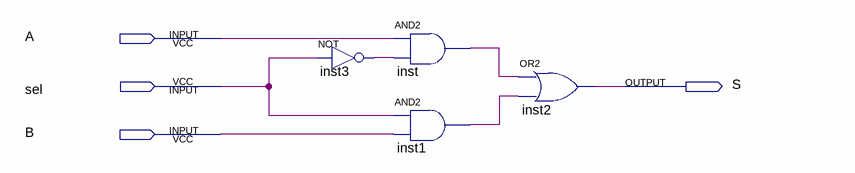
[diagram p0: schematic sheet]
// Quartus schematic MUX2_1bit.bdf as structural Verilog: 4 symbols, 4 pins
module MUX2_1bit (
  input  A,
  input  sel,
  input  B,
  output S
);

  wire inst1_out, inst3_out, inst_out;

  not inst3 (inst3_out, sel);
  and inst (inst_out, A, inst3_out);
  and inst1 (inst1_out, sel, B);
  or inst2 (S, inst_out, inst1_out);
endmodule
